# EAGLE design sensorboard (EAGLE 9.6.2)
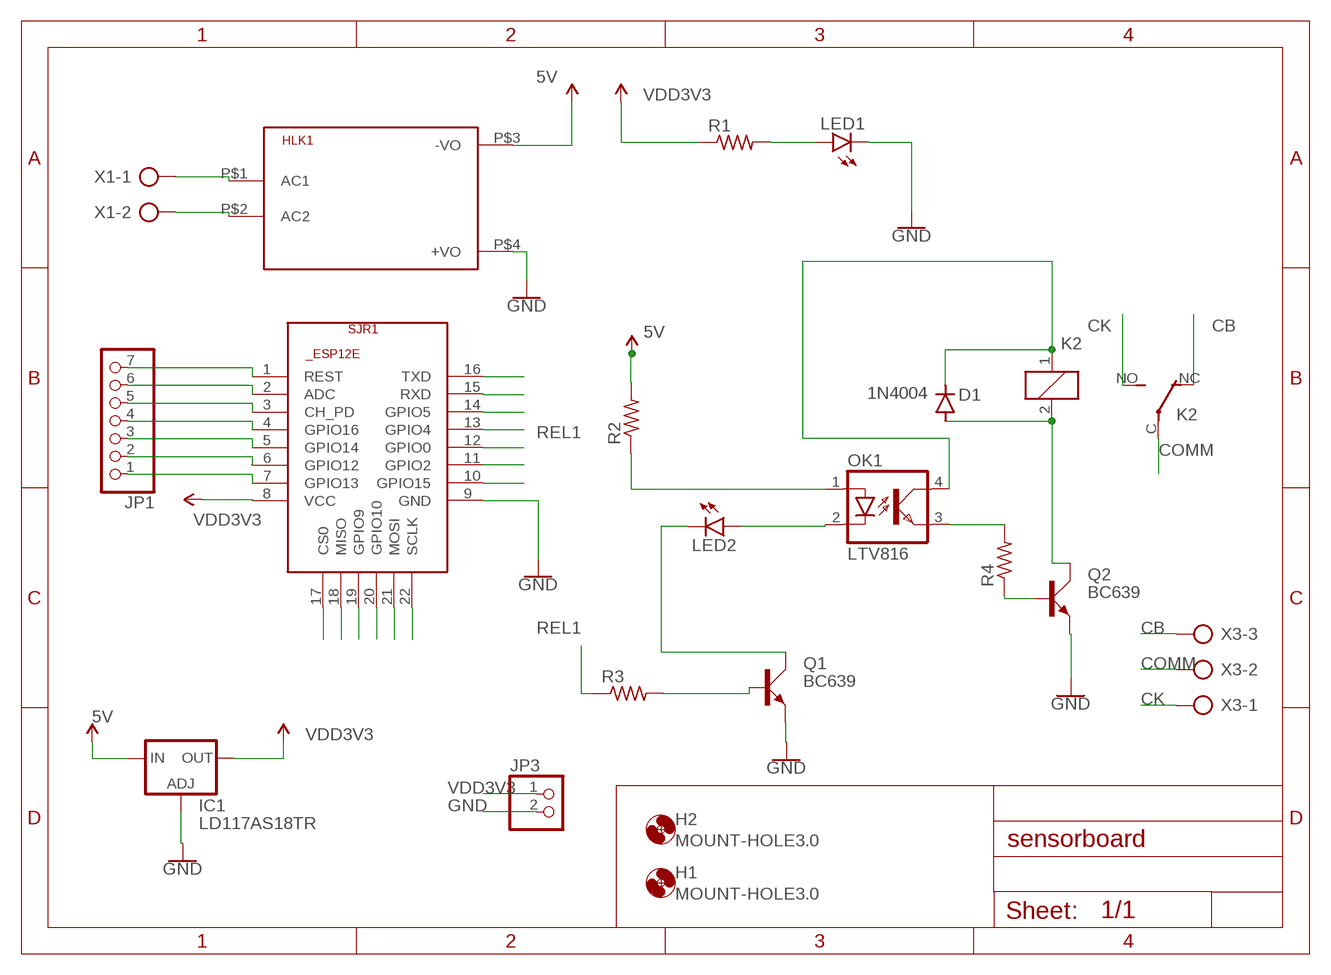
[diagram p0: schematic, sheet 1]

## Parts
D1  1N4004  [DO41-10]
H1  MOUNT-HOLE3.0  [3,0]
H2  MOUNT-HOLE3.0  [3,0]
HLK1  HLK-PM013W 5V  HLK-PM013W  [HLK-PM01]
IC1  LD117AS18TR  [SOT223]
JP1  PINHD-1X7  [1X07]
JP3  PINHD-1X2  [1X02]
K2  JTN-PCB-DC18V  [JT-PCB]
LED1  LED5MM  [LED5MM]
LED2  LED5MM  [LED5MM]
OK1  LTV816  [DIL04]
Q1  BC639  [SOT54D]
Q2  BC639  [SOT54D]
R1  R-US_0207/5V  [0207/5V]
R2  R-US_0207/5V  [0207/5V]
R3  R-US_0207/5V  [0207/5V]
R4  R-US_0207/5V  [0207/5V]
SJR1  ESP8266-12EESP12E  [ESP8266-ESP12E]
X1  AK500/2  [AK500/2]
X3  AK500/3  [AK500/3]

## Nets
5V: HLK1.P$3(-VO) IC1.3(IN) R2.2 ; supply symbol labelled VCC
ADC: JP1.6 SJR1.2(ADC)
CB: K2.NC(O) X3.3
CH_PD: JP1.5 SJR1.3(CH_PD)
CK: K2.NO(S) X3.1
COMM: K2.C(P) X3.2
CSO: SJR1.17(CS0)
GND: HLK1.P$4(+VO) IC1.1(ADJ) JP3.2 LED1.K(C) Q1.E Q2.E SJR1.9(GND)
GPIO2: SJR1.11(GPIO2)
GPIO4: SJR1.13(GPIO4)
GPIO5: SJR1.14(GPIO5)
GPIO9: SJR1.19(GPIO9)
GPIO10: SJR1.20(GPIO10)
GPIO12: JP1.2 SJR1.6(GPIO12)
GPIO13: JP1.1 SJR1.7(GPIO13)
GPIO14: JP1.3 SJR1.5(GPIO14)
GPIO15: SJR1.10(GPIO15)
GPIO16: JP1.4 SJR1.4(GPIO16)
MISO: SJR1.18(MISO)
MOSI: SJR1.21(MOSI)
N$1: HLK1.P$1(AC1) X1.1
N$2: HLK1.P$2(AC2) X1.2
N$3: LED1.A R1.2
N$4: OK1.1(A) R2.1
N$5: LED2.A OK1.2(C)
N$6: LED2.K(C) Q1.C
N$7: Q1.B R3.2
N$8: OK1.3(EMIT) R4.2
N$9: Q2.B R4.1
N$10: D1.C K2.1 OK1.4(COL)
N$11: D1.A K2.2 Q2.C
NRST: JP1.7 SJR1.1(REST)
REL1: R3.1 SJR1.12(GPIO0)
RXD0: SJR1.15(RXD)
SCLK: SJR1.22(SCLK)
TXDO: SJR1.16(TXD)
VDD3V3: IC1.4(OUT) JP3.1 R1.1 SJR1.8(VCC) ; supply symbol labelled VCC

## Library data of the parts
D1 = diode:1N4004: DIODE general purpose rectifier, 1 A
H1 H2 = holes:MOUNT-HOLE: MOUNTING HOLE with drill center marker
HLK1 = HLK-PM01:HLK-PM01: Hi-Link Power Supply HLK-PM01 3W Author: Ahmed Said <https://github.com/AhmedSaid/EAGLELibraries>
IC1 = v-reg:LD117A?*: Low drop fixed and adjustable positive voltage regulators 1 A Source: http://www.st.com/stonline/products/literature/ds/7194/ld1117axx.pdf
JP1 = pinhead:PINHD-1X7: PIN HEADER
JP3 = pinhead:PINHD-1X2: PIN HEADER
K2 = relay:JT?-*: COMPACT ECONOMICAL 30 AMP. RELAY NAiS Source: http://www.mew-europe.com/.. en_ds_61212_0000.pdf; OC_FARNELL: unknown; OC_NEWARK: unknown
LED1 LED2 = led:LED: LED OSRAM: - CHIPLED LG R971, LG N971, LY N971, LG Q971, LY Q971, LO R971, LY R971 LH N974, LH R974 LS Q976, LO Q976, LY Q976 LO Q996 - Hyper CHIPLED LW Q18S LB Q993, LB Q99A, LB R99A - SideLED LS A670, LO A670, LY A670, LG A670, LP A670 LB A673, LV A673, LT A673, LW A673 LH A674 LY A675 LS A676, LA A676, LO A676, LY A676, LW A676 LS A679, LY A679, LG A679 - Hyper Micro SIDELED® LS Y876, LA Y876, LO Y876, LY Y876 LT Y87S - SmartLED LW L88C, LW L88S LB L89C, LB L89S, LG L890 LS L89K, LO L89K, LY L89K LS L896, LA L896, LO L896, LY L896 - TOPLED LS T670, LO T670, LY T670, LG T670, LP T670 LSG T670, LSP T670, LSY T670, LOP T670, LYG T670 LG T671, LOG T671, LSG T671 LB T673, LV T673, LT T673, LW T673 LH T674 LS T676, LA T676, LO T676, LY T676, LB T676, LH T676, LSB T676, LW T676 LB T67C, LV T67C, LT T67C, LS T67K, LO T67K, LY T67K, LW E67C LS E67B, LA E67B, LO E67B, LY E67B, LB E67C, LV E67C, LT E67C LW T67C LS T679, LY T679, LG T679 LS T770, LO T770, LY T770, LG T770, LP T770 LB T773, LV T773, LT T773, LW T773 LH T774 LS E675, LA E675, LY E675, LS T675 LS T776, LA T776, LO T776, LY T776, LB T776 LHGB T686 LT T68C, LB T68C - Hyper Mini TOPLED® LB M676 - Mini TOPLED Santana® LG M470 LS M47K, LO M47K, LY M47K Source: http://www.osram.convergy.de LUXEON: - LUMILED® LXK2-PW12-R00, LXK2-PW12-S00, LXK2-PW14-U00, LXK2-PW14-V00 LXK2-PM12-R00, LXK2-PM12-S00, LXK2-PM14-U00 LXK2-PE12-Q00, LXK2-PE12-R00, LXK2-PE12-S00, LXK2-PE14-T00, LXK2-PE14-U00 LXK2-PB12-K00, LXK2-PB12-L00, LXK2-PB12-M00, LXK2-PB14-N00, LXK2-PB14-P00, LXK2-PB14-Q00 LXK2-PR12-L00, LXK2-PR12-M00, LXK2-PR14-Q00, LXK2-PR14-R00 LXK2-PD12-Q00, LXK2-PD12-R00, LXK2-PD12-S00 LXK2-PH12-R00, LXK2-PH12-S00 LXK2-PL12-P00, LXK2-PL12-Q00, LXK2-PL12-R00 Source: www.luxeon.com KINGBRIGHT: KA-3528ASYC Source: www.kingbright.com
OK1 = optocoupler:LTV816: OPTO COUPLER Source: LITEON, LTV816.pdf; OC_FARNELL: unknown; OC_NEWARK: unknown
Q1 Q2 = transistor-small-signal:BC639: NPN TRANSISTOR
R1-R4 = rcl:R-US_: RESISTOR, American symbol; SPICEPREFIX: R
SJR1 = esp12e:ESP8266-12E: ESP8266-12E Library for Eagle CAD The author not responsible for any damages or errors!. Created by Suhail jr.lt;/author>
X1 = con-ptr500:AK500/2: CONNECTOR; OC_FARNELL: unknown; OC_NEWARK: unknown
X3 = con-ptr500:AK500/3: CONNECTOR; OC_FARNELL: unknown; OC_NEWARK: unknown

## Board
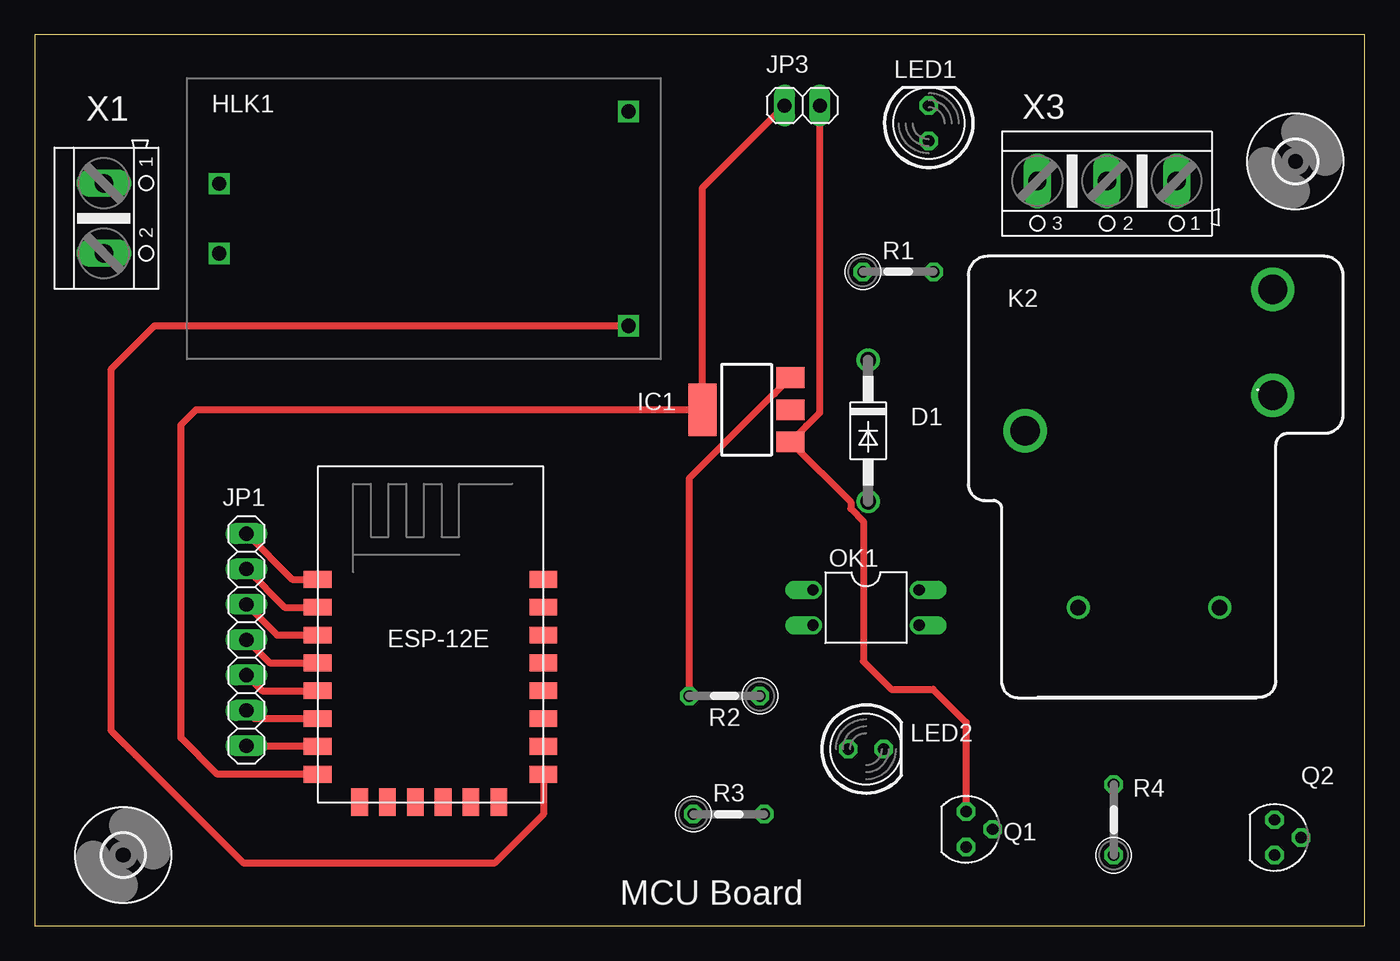
[diagram p1: board, top side]
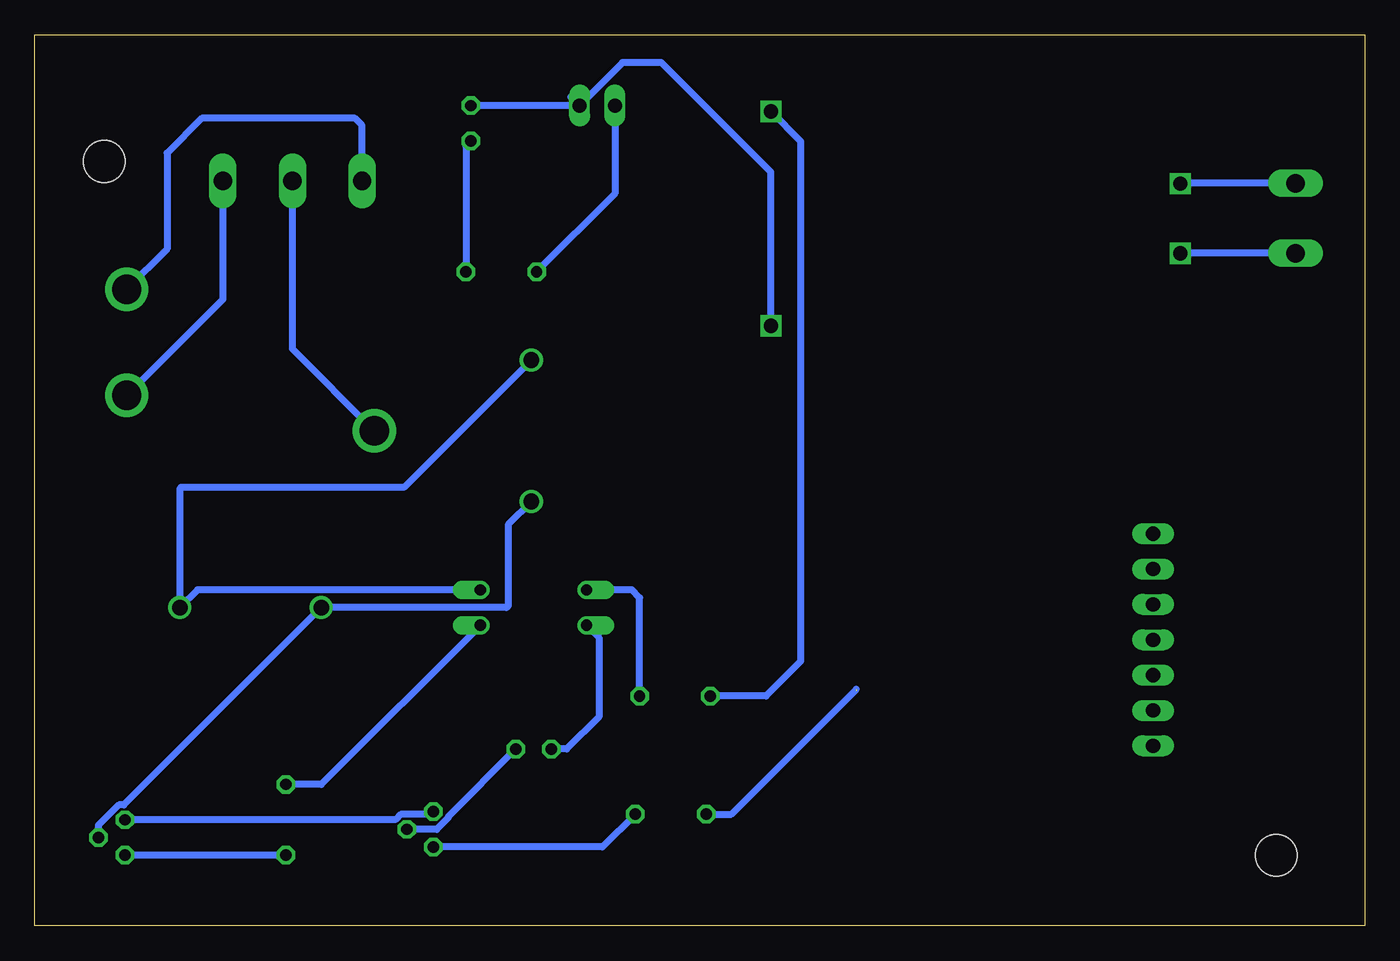
[diagram p2: board, bottom side, seen from below]

Size 95.5 x 64 mm. Coordinates in mm from the lower left corner, seen from the top.
Outline: 0,0 95.5,0 95.5,64 0,64 0,0
Copper layers (1*16): Top 0.035mm / dielectric 1.5mm / Bottom 0.035mm
Design rules "default": minimum track width 6mil, minimum drill 0.35mm, track to track 6mil, track to pad 6mil, pad to pad 6mil, via to via 6mil, smd to smd 6mil, copper to edge 40mil, drill to drill 6mil, minimum pad ring 10mil, minimum via ring 8mil, stop-mask expansion 4mil, vias tented up to drill 0mil, thermal gap 10mil

### Footprints (pad centres in the part's own frame; a part is rotated, then mirrored left to right if it is on the bottom)
DO41-10 = drill 1.118: A 5.08,0; C -5.08,0
3,0 = hole 3: 0,0
HLK-PM01 = drill 1.016 square: P$1 -14.7,2.5; P$2 -14.7,-2.5; P$3 14.7,7.7; P$4 14.7,-7.7
SOT223 = smd 1.5 x 2: 1 -2.3,-3.15; 2 0,-3.15; 3 2.3,-3.15 | smd 3.8 x 2: 4 0,3.15
1X07 = drill 1.016 long: 1 -7.62,0; 2 -5.08,0; 3 -2.54,0; 4 0,0; 5 2.54,0; 6 5.08,0; 7 7.62,0
1X02 = drill 1.016 long: 1 -1.27,0; 2 1.27,0
JT-PCB = drill 1.1: 1 5.08,0; 2 -5.08,0 | drill 2.1: C -8.89,12.7; NC 8.89,22.86; NO 8.89,15.24
LED5MM = drill 0.813 octagon: A -1.27,0; K 1.27,0
DIL04 = drill 0.813 offset: 1 -1.27,-3.81; 2 1.27,-3.81; 3 1.27,3.81; 4 -1.27,3.81
SOT54D = drill 0.813 octagon: B 1.27,0; C 0,1.905; E -1.27,0
0207/5V = drill 0.813 octagon: 1 -2.54,0; 2 2.54,0
ESP8266-ESP12E = smd 2 x 1.2: 1 -7.62,5.84; 2 -7.62,3.84; 3 -7.62,1.84; 4 -7.62,-0.16; 5 -7.62,-2.16; 6 -7.62,-4.16; 7 -7.62,-6.16; 8 -7.62,-8.16; 9 8.58,-8.16; 10 8.58,-6.16; 11 8.58,-4.16; 12 8.58,-2.16; 13 8.58,-0.16; 14 8.58,1.84; 15 8.58,3.84; 16 8.58,5.84 | smd 1.2 x 2: 17 -4.62,-10.16; 18 -2.62,-10.16; 19 -0.62,-10.16; 20 1.38,-10.16; 21 3.38,-10.16; 22 5.38,-10.16
AK500/2 = drill 1.321 long: 1 -2.515,0; 2 2.515,0
AK500/3 = drill 1.321 long: 1 -5.004,0; 2 0,0; 3 5.004,0

### Placement (x,y rotation side)
D1  59.84,35.56 270 top
H1  90.52,54.91 0 top
H2  6.35,5.08 0 top
HLK1  27.94,50.8 0 top
IC1  51.11,37.07 90 top
JP1  15.2,20.55 90 top
JP3  55.11,58.92 0 top
K2  80.01,22.86 0 top
LED1  64.2,57.65 90 top
LED2  59.69,12.7 0 top
OK1  59.69,22.86 270 top
Q1  66.88,6.93 270 top
Q2  89.03,6.35 270 top
R1  62.01,46.98 0 top
R2  49.53,16.51 180 top
R3  49.83,8.03 0 top
R4  77.47,7.62 90 top
SJR1  27.94,19.05 0 top
X1  4.95,50.83 270 top
X3  77,53.5 180 top

### Tracks (layer width: path | path; a pad name or v marks a point on that pad's centre or on a via)
5V
  Top 0.508: IC1.3 53.12,38.23 53.09,38.23 46.99,32.12 R2.2
  Bottom 0.508: HLK1.P$3 40.5,56.36 40.5,19 42.99,16.51 R2.2
ADC
  Top 0.508: JP1.6 17.94,22.89 SJR1.2
CB
  Bottom 0.508: X3.3 72,57.5 72.5,58 83.5,58 86,55.5 86,48.62 K2.NC
CH_PD
  Top 0.508: JP1.5 17.4,20.89 SJR1.3
CK
  Bottom 0.508: X3.1 82,45 K2.NO
COMM
  Bottom 0.508: K2.C 77,41.44 X3.2
GND
  Top 0.508: SJR1.9 36.52,8.02 33,4.5 15,4.5 5.5,14 5.5,40 8.6,43.1 HLK1.P$4 | JP3.2 56.38,36.87 55.43,35.91 55.4,35.91 IC1.1 58.6,30.43 58.6,29.96 59.5,29.06 59.5,19 61.5,17 64.5,17 66.88,14.62 Q1.E
  Bottom 0.508: 57,59.54 JP3.2 | Q2.E 69.61,7.62 69.22,8 67.08,8 Q1.E | HLK1.P$4 42.64,54.14 50.5,62 53.3,62 JP3.2 | JP3.2 LED1.K
GPIO12
  Top 0.508: JP1.2 15.78,14.89 SJR1.6
GPIO13
  Top 0.508: JP1.1 20.28,12.93 SJR1.7
GPIO14
  Top 0.508: JP1.3 16.32,16.89 SJR1.5
GPIO16
  Top 0.508: JP1.4 16.86,18.89 SJR1.4
N$1
  Bottom 0.508: X1.1 13.2,53.34 HLK1.P$1
N$2
  Bottom 0.508: X1.2 13.23,48.31 HLK1.P$2
N$3
  Bottom 0.508: LED1.A 64.55,56.03 R1.2
N$4
  Bottom 0.508: R2.1 52.07,23.57 52.63,24.13 OK1.1
N$5
  Bottom 0.508: OK1.2 55,20.71 55,15 57.3,12.7 LED2.A
N$6
  Bottom 0.508: LED2.K 65.81,7.85 65.81,7.76 66.64,6.93 Q1.C
N$7
  Bottom 0.508: R3.2 54.74,5.66 Q1.B
N$8
  Bottom 0.508: OK1.3 74.93,10.16 R4.2
N$9
  Bottom 0.508: R4.1 Q2.B
N$10
  Bottom 0.508: D1.C 68.98,31.5 85,31.5 85.09,31.41 K2.1 83.82,24.13 OK1.4
N$11
  Bottom 0.508: Q2.C 90.93,7.22 89.47,8.69 89.1,8.69 K2.2 61.64,22.86 61.5,23 61.5,28.82 D1.A
NRST
  Top 0.508: JP1.7 18.48,24.89 SJR1.1
REL1  (1 unrouted)
  Bottom 0.508: R3.1 45.47,8.03 36.5,17
VDD3V3
  Top 0.508: SJR1.8 13.11,10.89 10.5,13.5 10.5,36 11.57,37.07 IC1.4 47.96,53.04 JP3.1
  Bottom 0.508: JP3.1 53.84,52.6 R1.1

### Text on the board
tPlace: MCU Board